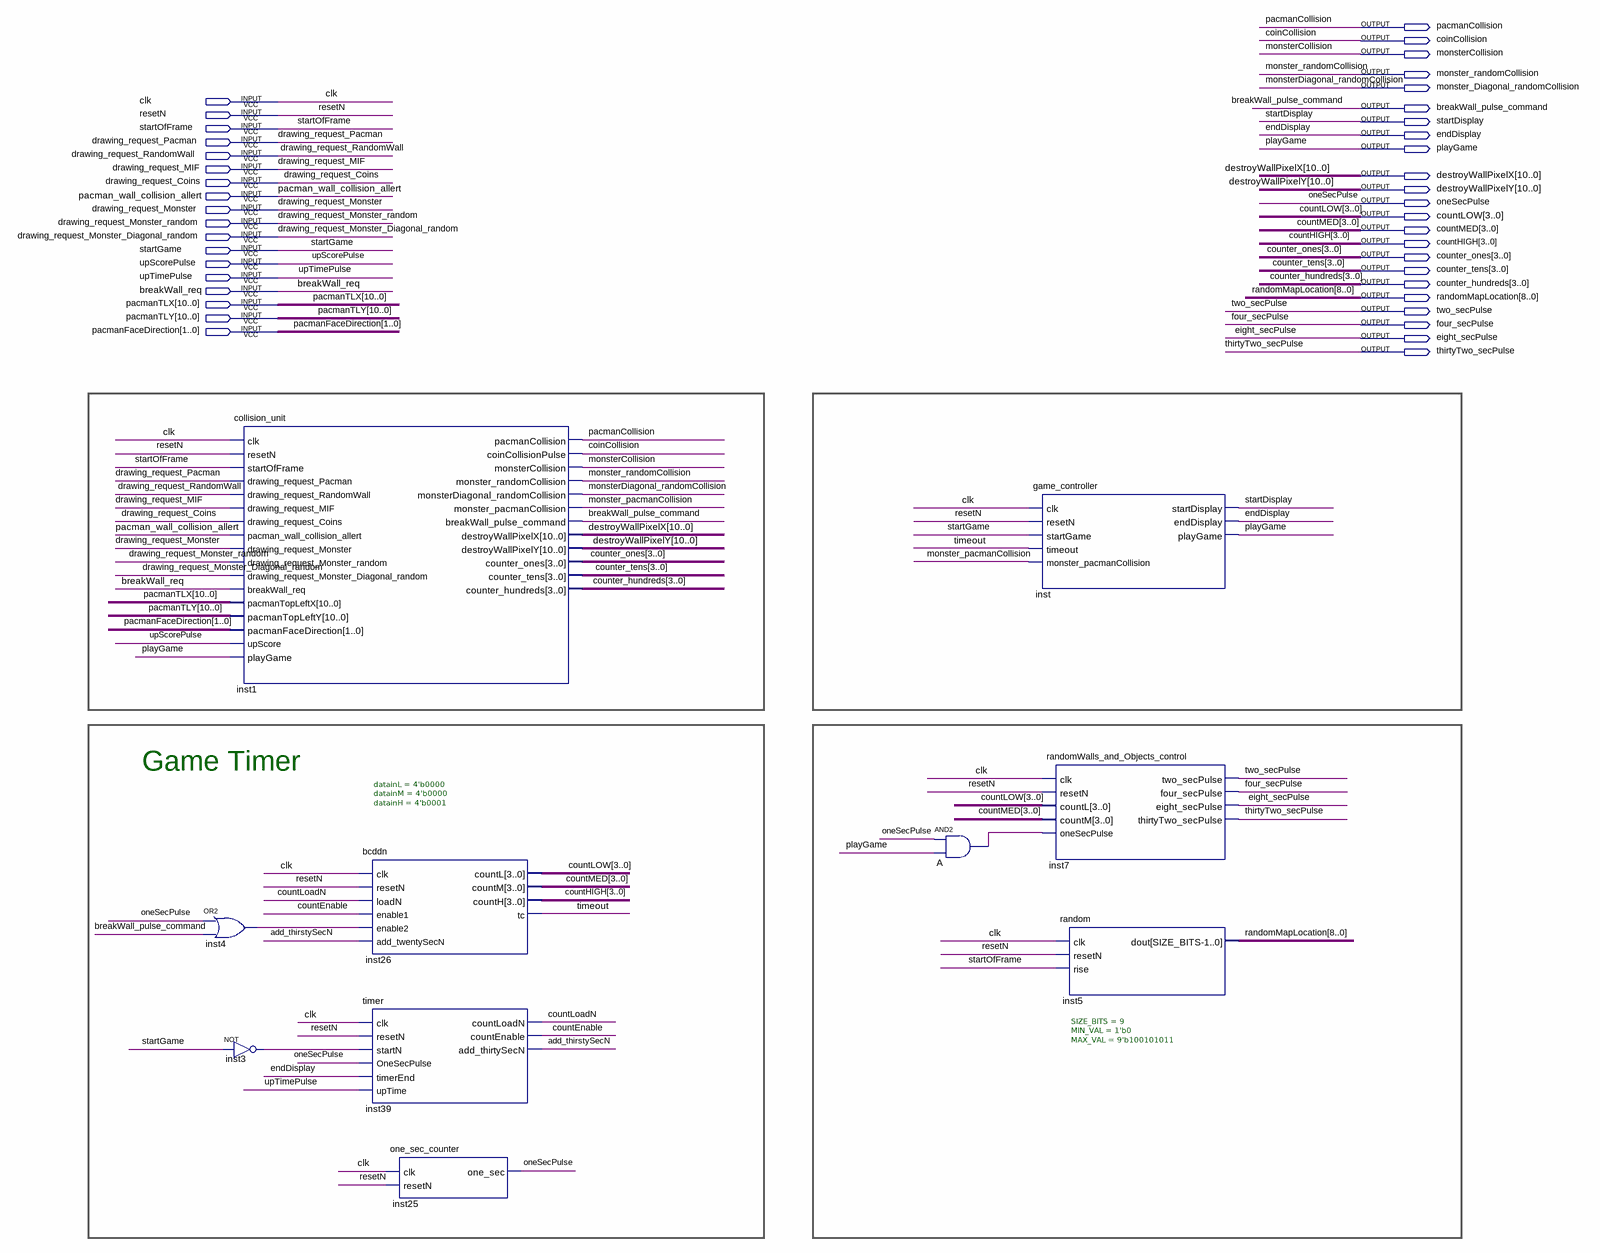
[diagram p0: schematic sheet]
// Quartus schematic Control_Block.bdf as structural Verilog: 10 symbols, 41 pins
module Control_Block (
  input  clk,
  input  resetN,
  input  startOfFrame,
  input  drawing_request_Pacman,
  input  drawing_request_RandomWall,
  input  drawing_request_MIF,
  input  drawing_request_Coins,
  input  pacman_wall_collision_allert,
  input  drawing_request_Monster,
  input  drawing_request_Monster_random,
  input  drawing_request_Monster_Diagonal_random,
  input  startGame,
  input  upScorePulse,
  input  upTimePulse,
  input  breakWall_req,
  input  [10:0] pacmanTLX,
  input  [10:0] pacmanTLY,
  input  [1:0] pacmanFaceDirection,
  output pacmanCollision,
  output coinCollision,
  output monsterCollision,
  output monster_randomCollision,
  output monster_Diagonal_randomCollision,
  output breakWall_pulse_command,
  output startDisplay,
  output endDisplay,
  output playGame,
  output [10:0] destroyWallPixelX,
  output [10:0] destroyWallPixelY,
  output oneSecPulse,
  output [3:0] countLOW,
  output [3:0] countMED,
  output [3:0] countHIGH,
  output [3:0] counter_ones,
  output [3:0] counter_tens,
  output [3:0] counter_hundreds,
  output [8:0] randomMapLocation,
  output two_secPulse,
  output four_secPulse,
  output eight_secPulse,
  output thirtyTwo_secPulse
);

  wire A_out, add_thirstySecN, countEnable, countLoadN, inst3_out, inst4_out, monster_pacmanCollision,
       timeout;

  or inst4 (inst4_out, oneSecPulse, breakWall_pulse_command);
  collision_unit inst1 (
    .clk(clk), .resetN(resetN), .startOfFrame(startOfFrame), .drawing_request_Pacman(drawing_request_Pacman),
    .drawing_request_RandomWall(drawing_request_RandomWall), .drawing_request_MIF(drawing_request_MIF),
    .drawing_request_Coins(drawing_request_Coins),
    .pacman_wall_collision_allert(pacman_wall_collision_allert),
    .drawing_request_Monster(drawing_request_Monster),
    .drawing_request_Monster_random(drawing_request_Monster_random),
    .drawing_request_Monster_Diagonal_random(drawing_request_Monster_Diagonal_random),
    .breakWall_req(breakWall_req), .pacmanTopLeftX(pacmanTLX), .pacmanTopLeftY(pacmanTLY),
    .pacmanFaceDirection(pacmanFaceDirection), .upScore(upScorePulse), .playGame(playGame),
    .pacmanCollision(pacmanCollision), .coinCollisionPulse(coinCollision),
    .monsterCollision(monsterCollision), .monster_randomCollision(monster_randomCollision),
    .monsterDiagonal_randomCollision(monster_Diagonal_randomCollision),
    .monster_pacmanCollision(monster_pacmanCollision), .breakWall_pulse_command(breakWall_pulse_command),
    .destroyWallPixelX(destroyWallPixelX), .destroyWallPixelY(destroyWallPixelY),
    .counter_ones(counter_ones), .counter_tens(counter_tens), .counter_hundreds(counter_hundreds));
  not inst3 (inst3_out, startGame);
  bcddn #(.datainL(4'b0000), .datainM(4'b0000), .datainH(4'b0001)) inst26 (
    .clk(clk), .resetN(resetN), .loadN(countLoadN), .enable1(countEnable), .enable2(inst4_out),
    .add_twentySecN(add_thirstySecN), .countL(countLOW), .countM(countMED), .countH(countHIGH), .tc(timeout));
  timer inst39 (
    .clk(clk), .resetN(resetN), .startN(inst3_out), .OneSecPulse(oneSecPulse), .timerEnd(endDisplay),
    .upTime(upTimePulse), .countLoadN(countLoadN), .countEnable(countEnable), .add_thirtySecN(add_thirstySecN));
  one_sec_counter inst25 (.clk(clk), .resetN(resetN), .one_sec(oneSecPulse));
  and A (A_out, oneSecPulse, playGame);
  game_controller inst (
    .clk(clk), .resetN(resetN), .startGame(startGame), .timeout(timeout),
    .monster_pacmanCollision(monster_pacmanCollision), .startDisplay(startDisplay), .endDisplay(endDisplay),
    .playGame(playGame));
  randomWalls_and_Objects_control inst7 (
    .clk(clk), .resetN(resetN), .countL(countLOW), .countM(countMED), .oneSecPulse(A_out),
    .two_secPulse(two_secPulse), .four_secPulse(four_secPulse), .eight_secPulse(eight_secPulse),
    .thirtyTwo_secPulse(thirtyTwo_secPulse));
  random #(.SIZE_BITS(9), .MIN_VAL(1'b0), .MAX_VAL(9'b100101011)) inst5 (
    .clk(clk), .resetN(resetN), .rise(startOfFrame), .dout(randomMapLocation));

  // Other names for the same wires on the sheet: monsterDiagonal_randomCollision = monster_Diagonal_randomCollision

  // Notes on the sheet:
  //   Game Timer
endmodule
